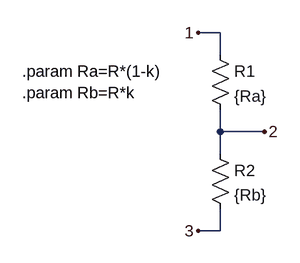
[diagram p0: schematic pot_lin.asc]
pot_lin.asc, the LTspice schematic file:
Version 4
SHEET 1 880 680
WIRE 336 160 304 160
WIRE 336 192 336 160
WIRE 336 304 336 272
WIRE 400 304 336 304
WIRE 336 336 336 304
WIRE 336 448 336 416
WIRE 336 448 304 448
FLAG 304 160 1
FLAG 400 304 2
FLAG 304 448 3
SYMBOL res 320 176 R0
SYMATTR InstName R1
SYMATTR Value {Ra}
SYMBOL res 320 320 R0
SYMATTR InstName R2
SYMATTR Value {Rb}
TEXT 48 216 Left 2 !.param Ra=R*(1-k)\n.param Rb=R*k

The netlist it stands for:
* pot_lin.asc
R1 1 2 {Ra}
R2 2 3 {Rb}
.param Ra=R*(1-k)
.param Rb=R*k
.backanno
.end